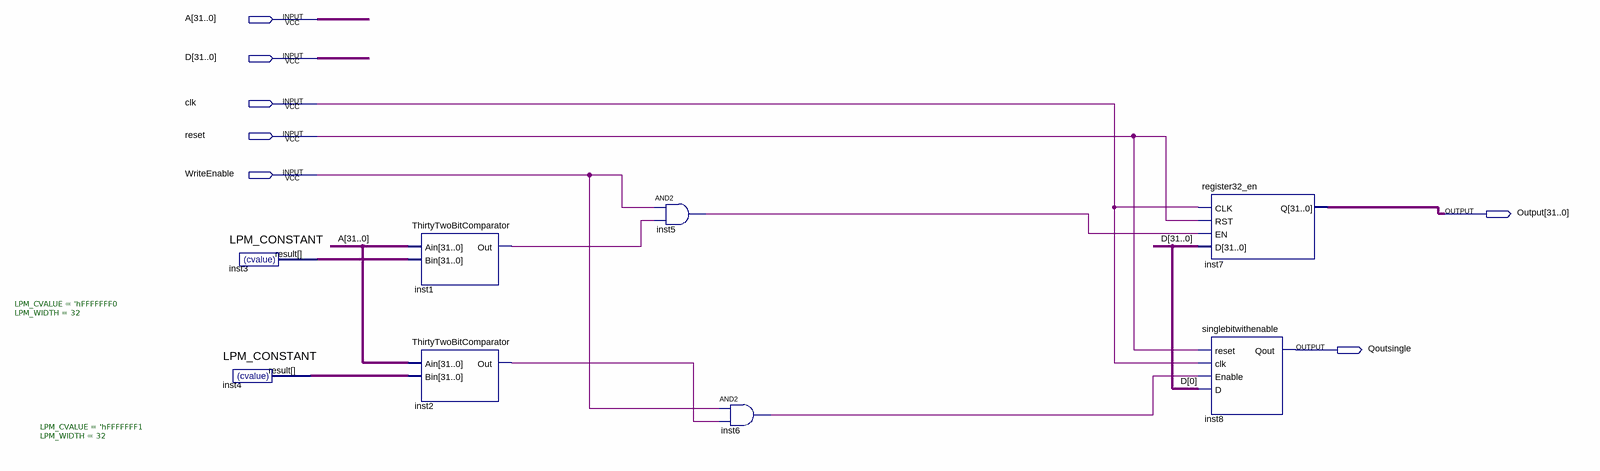
[diagram p0: schematic sheet]
// Quartus schematic DisplayDriver_part.bdf as structural Verilog: 8 symbols, 7 pins
module DisplayDriver_part (
  input  [31:0] A,
  input  [31:0] D,
  input  clk,
  input  reset,
  input  WriteEnable,
  output [31:0] Output,
  output Qoutsingle
);

  wire inst1_out, inst2_out, inst5_out, inst6_out;
  wire [31:0] inst3_result, inst4_result;

  LPM_CONSTANT #(.LPM_CVALUE('hFFFFFFF0), .LPM_WIDTH(32)) inst3 (.result(inst3_result));
  LPM_CONSTANT #(.LPM_CVALUE('hFFFFFFF1), .LPM_WIDTH(32)) inst4 (.result(inst4_result));
  ThirtyTwoBitComparator inst1 (.Ain(A), .Bin(inst3_result), .Out(inst1_out));
  ThirtyTwoBitComparator inst2 (.Ain(A), .Bin(inst4_result), .Out(inst2_out));
  and inst5 (inst5_out, WriteEnable, inst1_out);
  and inst6 (inst6_out, WriteEnable, inst2_out);
  register32_en inst7 (.CLK(clk), .RST(reset), .EN(inst5_out), .D(D), .Q(Output));
  singlebitwithenable inst8 (.reset(reset), .clk(clk), .Enable(inst6_out), .D(D[0]), .Qout(Qoutsingle));
endmodule
